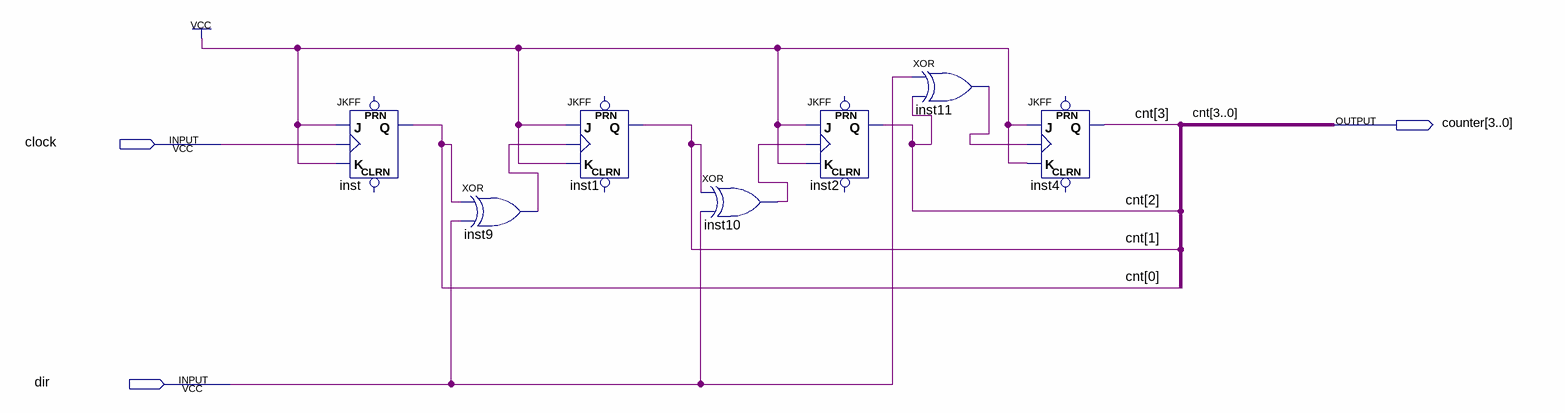
[diagram p0: schematic sheet]
// Quartus schematic jk_counter.bdf as structural Verilog: 7 symbols, 3 pins
module jk_counter (
  input  clock,
  input  dir,
  output [3:0] counter
);

  wire inst9_out, inst10_out, inst11_out;

  JKFF inst (.K(1'b1), .J(1'b1), .CLK(clock), .Q(counter[0]));  // open: PRN, CLRN
  xor inst9 (inst9_out, counter[0], dir);
  JKFF inst1 (.K(1'b1), .J(1'b1), .CLK(inst9_out), .Q(counter[1]));  // open: PRN, CLRN
  xor inst10 (inst10_out, counter[1], dir);
  JKFF inst2 (.K(1'b1), .J(1'b1), .CLK(inst10_out), .Q(counter[2]));  // open: PRN, CLRN
  xor inst11 (inst11_out, dir, counter[2]);
  JKFF inst4 (.K(1'b1), .J(1'b1), .CLK(inst11_out), .Q(counter[3]));  // open: PRN, CLRN

  // Other names for the same wires on the sheet: cnt[3:0] = counter
endmodule
